# Altium project MCU_Board.PrjPcb
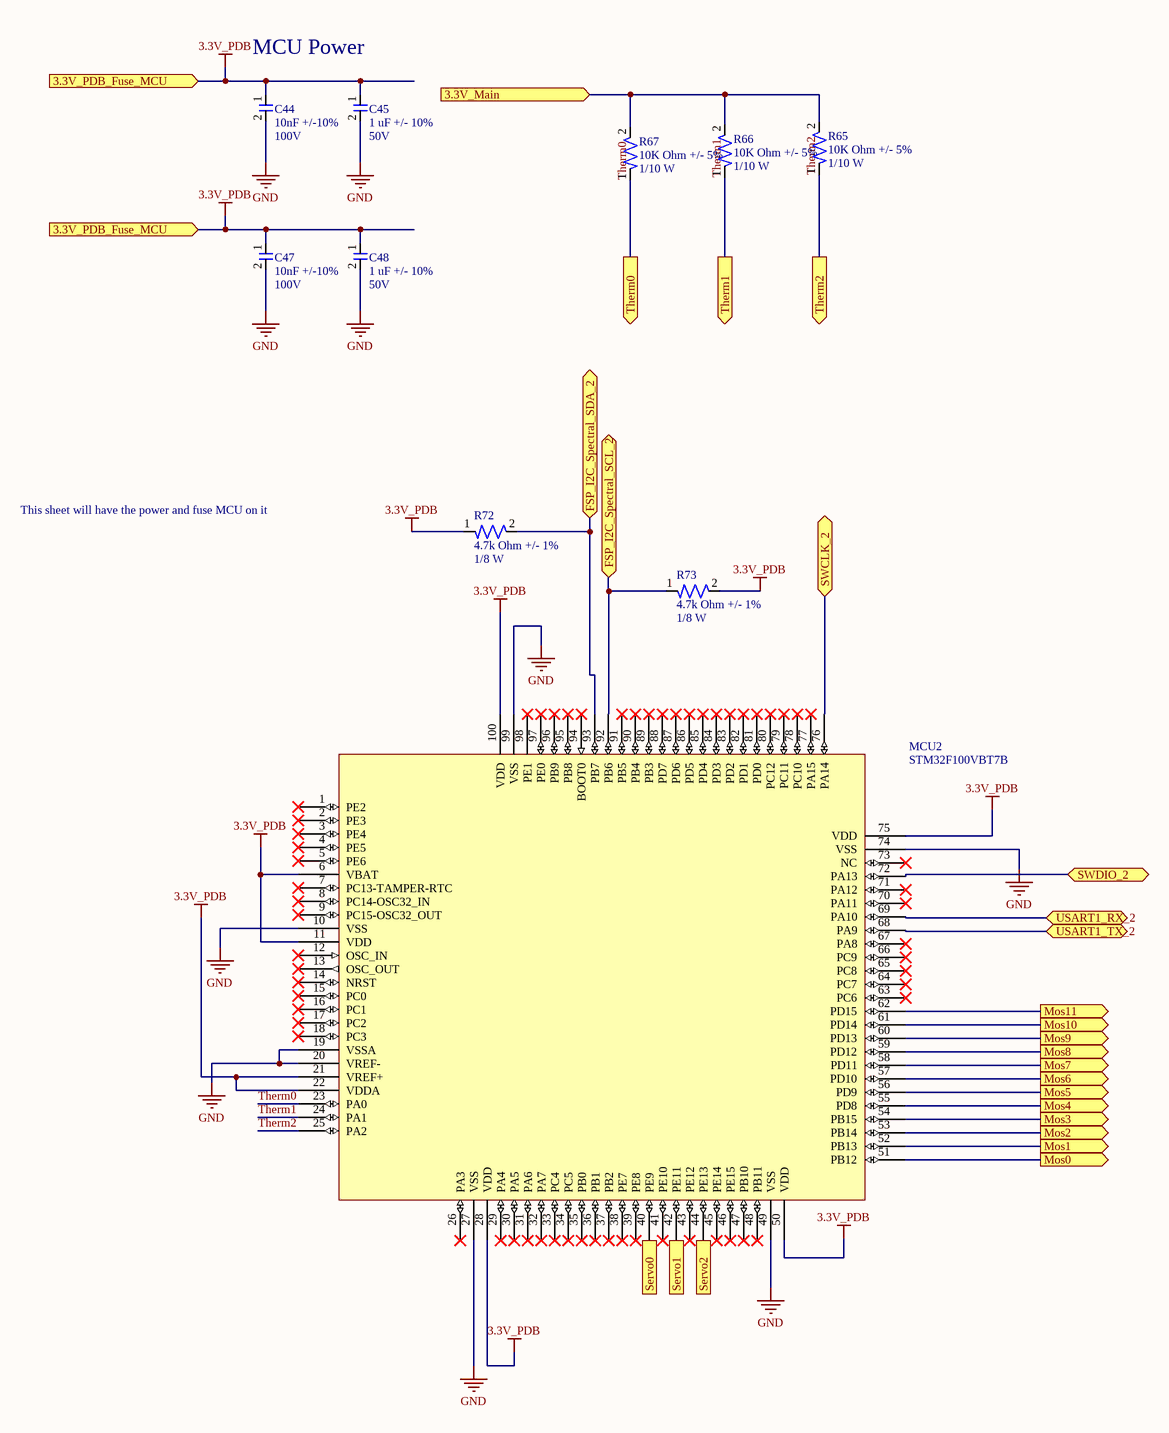
[diagram p0: 6_Power_Fuse_MCU.SchDoc]
1 sheet, 10 parts. Net scope: flat (ports and power ports of the same name join across sheets).
Board file: MCU_Board.PcbDoc

## Sheet 6_Power_Fuse_MCU.SchDoc
size A3; SheetNumber: 5; SheetTotal: 5

### Parts
C44  Capacitance: 10nF +/-10%  Voltage Rating: 100V  [CAP-0603]  (hidden comment: CC0603KRX7R0BB103)
C45  Cap: 1 uF +/- 10%  Voltage: 50V  [CAP-0805]  (hidden comment: GCM21BR71H105KA03L)
C47  Capacitance: 10nF +/-10%  Voltage Rating: 100V  [CAP-0603]  (hidden comment: CC0603KRX7R0BB103)
C48  Cap: 1 uF +/- 10%  Voltage: 50V  [CAP-0805]  (hidden comment: GCM21BR71H105KA03L)
MCU2  STM32F100VBT7B  [IC-STM32F100-0001]
R65  Resistance: 10K Ohm +/- 5%  Power: 1/10 W  [RES-0402]  (hidden comment: ERJ2GEJ103X)
R66  Resistance: 10K Ohm +/- 5%  Power: 1/10 W  [RES-0402]  (hidden comment: ERJ2GEJ103X)
R67  Resistance: 10K Ohm +/- 5%  Power: 1/10 W  [RES-0402]  (hidden comment: ERJ2GEJ103X)
R72  Resistance: 4.7k Ohm +/- 1%  Power: 1/8 W  [RES-0402]  (hidden comment: RC0402FR-7W4K7L)
R73  Resistance: 4.7k Ohm +/- 1%  Power: 1/8 W  [RES-0402]  (hidden comment: RC0402FR-7W4K7L)

### Ports
3.3V_Main (in), 3.3V_PDB_Fuse_MCU (in), FSP_I2C_Spectral_SCL_2 (bidir), FSP_I2C_Spectral_SDA_2 (bidir), Mos0 (out), Mos1 (out), Mos2 (out), Mos3 (out), Mos4 (out), Mos5 (out), Mos6 (out), Mos7 (out), Mos8 (out), Mos9 (out), Mos10 (out), Mos11 (out), Servo0 (out), Servo1 (out), Servo2 (out), SWCLK_2 (bidir), SWDIO_2 (bidir), Therm0 (out), Therm1 (out), Therm2 (out), USART1_RX_2 (bidir), USART1_TX_2 (bidir)

### Nets
3.3V_PDB: C44.1 C45.1 C47.1 C48.1 MCU2.6(VBAT) MCU2.11(VDD) MCU2.21(VREF+) MCU2.22(VDDA) MCU2.28(VDD) MCU2.50(VDD) MCU2.75(VDD) MCU2.100(VDD) R72.1 R73.2 ; port 3.3V_PDB_Fuse_MCU
GND: C44.2 C45.2 C47.2 C48.2 MCU2.10(VSS) MCU2.19(VSSA) MCU2.20(VREF-) MCU2.27(VSS) MCU2.49(VSS) MCU2.74(VSS) MCU2.99(VSS)
Therm0: MCU2.23(PA0) R67.1 ; port Therm0
Therm1: MCU2.24(PA1) R66.1 ; port Therm1
Therm2: MCU2.25(PA2) R65.1 ; port Therm2
NetMCU2_40: MCU2.40(PE9) ; port Servo0
NetMCU2_42: MCU2.42(PE11) ; port Servo1
NetMCU2_44: MCU2.44(PE13) ; port Servo2
NetMCU2_51: MCU2.51(PB12) ; port Mos0
NetMCU2_52: MCU2.52(PB13) ; port Mos1
NetMCU2_53: MCU2.53(PB14) ; port Mos2
NetMCU2_54: MCU2.54(PB15) ; port Mos3
NetMCU2_55: MCU2.55(PD8) ; port Mos4
NetMCU2_56: MCU2.56(PD9) ; port Mos5
NetMCU2_57: MCU2.57(PD10) ; port Mos6
NetMCU2_58: MCU2.58(PD11) ; port Mos7
NetMCU2_59: MCU2.59(PD12) ; port Mos8
NetMCU2_60: MCU2.60(PD13) ; port Mos9
NetMCU2_61: MCU2.61(PD14) ; port Mos10
NetMCU2_62: MCU2.62(PD15) ; port Mos11
NetMCU2_68: MCU2.68(PA9) ; port USART1_TX_2
NetMCU2_69: MCU2.69(PA10) ; port USART1_RX_2
NetMCU2_72: MCU2.72(PA13) ; port SWDIO_2
NetMCU2_76: MCU2.76(PA14) ; port SWCLK_2
NetMCU2_92: MCU2.92(PB6) R73.1 ; port FSP_I2C_Spectral_SCL_2
NetMCU2_93: MCU2.93(PB7) R72.2 ; port FSP_I2C_Spectral_SDA_2
NetR65_2: R65.2 R66.2 R67.2 ; port 3.3V_Main

Not connected (* = marked no-connect by the designer): MCU2 1(PE2)* 2(PE3)* 3(PE4)* 4(PE5)* 5(PE6)* 7(PC13-TAMPER-RTC)* 8(PC14-OSC32_IN)* 9(PC15-OSC32_OUT)* 12(OSC_IN)* 13(OSC_OUT)* 14(NRST)* 15(PC0)* 16(PC1)* 17(PC2)* 18(PC3)* 26(PA3)* 29(PA4)* 30(PA5)* 31(PA6)* 32(PA7)* 33(PC4)* 34(PC5)* 35(PB0)* 36(PB1)* 37(PB2)* 38(PE7)* 39(PE8)* 41(PE10)* 43(PE12)* 45(PE14)* 46(PE15)* 47(PB10)* 48(PB11)* 63(PC6)* 64(PC7)* 65(PC8)* 66(PC9)* 67(PA8)* 70(PA11)* 71(PA12)* 73(NC)* 77(PA15)* 78(PC10)* 79(PC11)* 80(PC12)* 81(PD0)* 82(PD1)* 83(PD2)* 84(PD3)* 85(PD4)* 86(PD5)* 87(PD6)* 88(PD7)* 89(PB3)* 90(PB4)* 91(PB5)* 94(BOOT0)* 95(PB8)* 96(PB9)* 97(PE0)* 98(PE1)*

### Notes on the sheet
- MCU Power
- This sheet will have the power and fuse MCU on it

### Library data of the parts
C44 C47 = CAP-10N-0003-JLC: 100V 10nF X7R ±10% 0603 Multilayer Ceramic Capacitors MLCC - SMD/SMT ROHS; Manufacturer: Yageo; Assembled?: yes; Manufacturer Part Number: CC0603KRX7R0BB103; Temperature Coefficient: X7R; Package Size: 0603; JLC Part Number: C107059
C45 C48 = CAP-1U-0003-JLC: 50V 1uF X7R ±10% 0805 Multilayer Ceramic Capacitors MLCC - SMD/SMT ROHS; assembled?: yes; JLC Part Number: C126592
MCU2 = IC-STM32F100-0001: ARM® Cortex®-M3 STM32F1 Microcontroller IC 32-Bit Single-Core 24MHz 128KB (128K x 8) FLASH 100-LQFP (14x14); VCC: 2 ~ 3.6V; Manufacturer Part Number: STM32F100VBT7B; Package Size: 100-LQFP
R65-R67 = RES-10K-0003-JLC: 100mW Thick Film Resistors 100V ±5% ±200ppm/℃ -55℃~+155℃ 10kΩ 0402  Chip Resistor - Surface Mount ROHS; assembled?: yes; JLC part number: C278577
R72 R73 = RES-4.7K-0003-JLC: 125mW Thick Film Resistors 50V ±1% ±200ppm/℃ -55℃~+155℃ 4.7kΩ 0402  Chip Resistor - Surface Mount ROHS; assembled?: yes; JLC part number: C606173